# EAGLE schematic greenhousectrl-latest-monday-no-errors-fixed-cap (EAGLE 7.7.0)
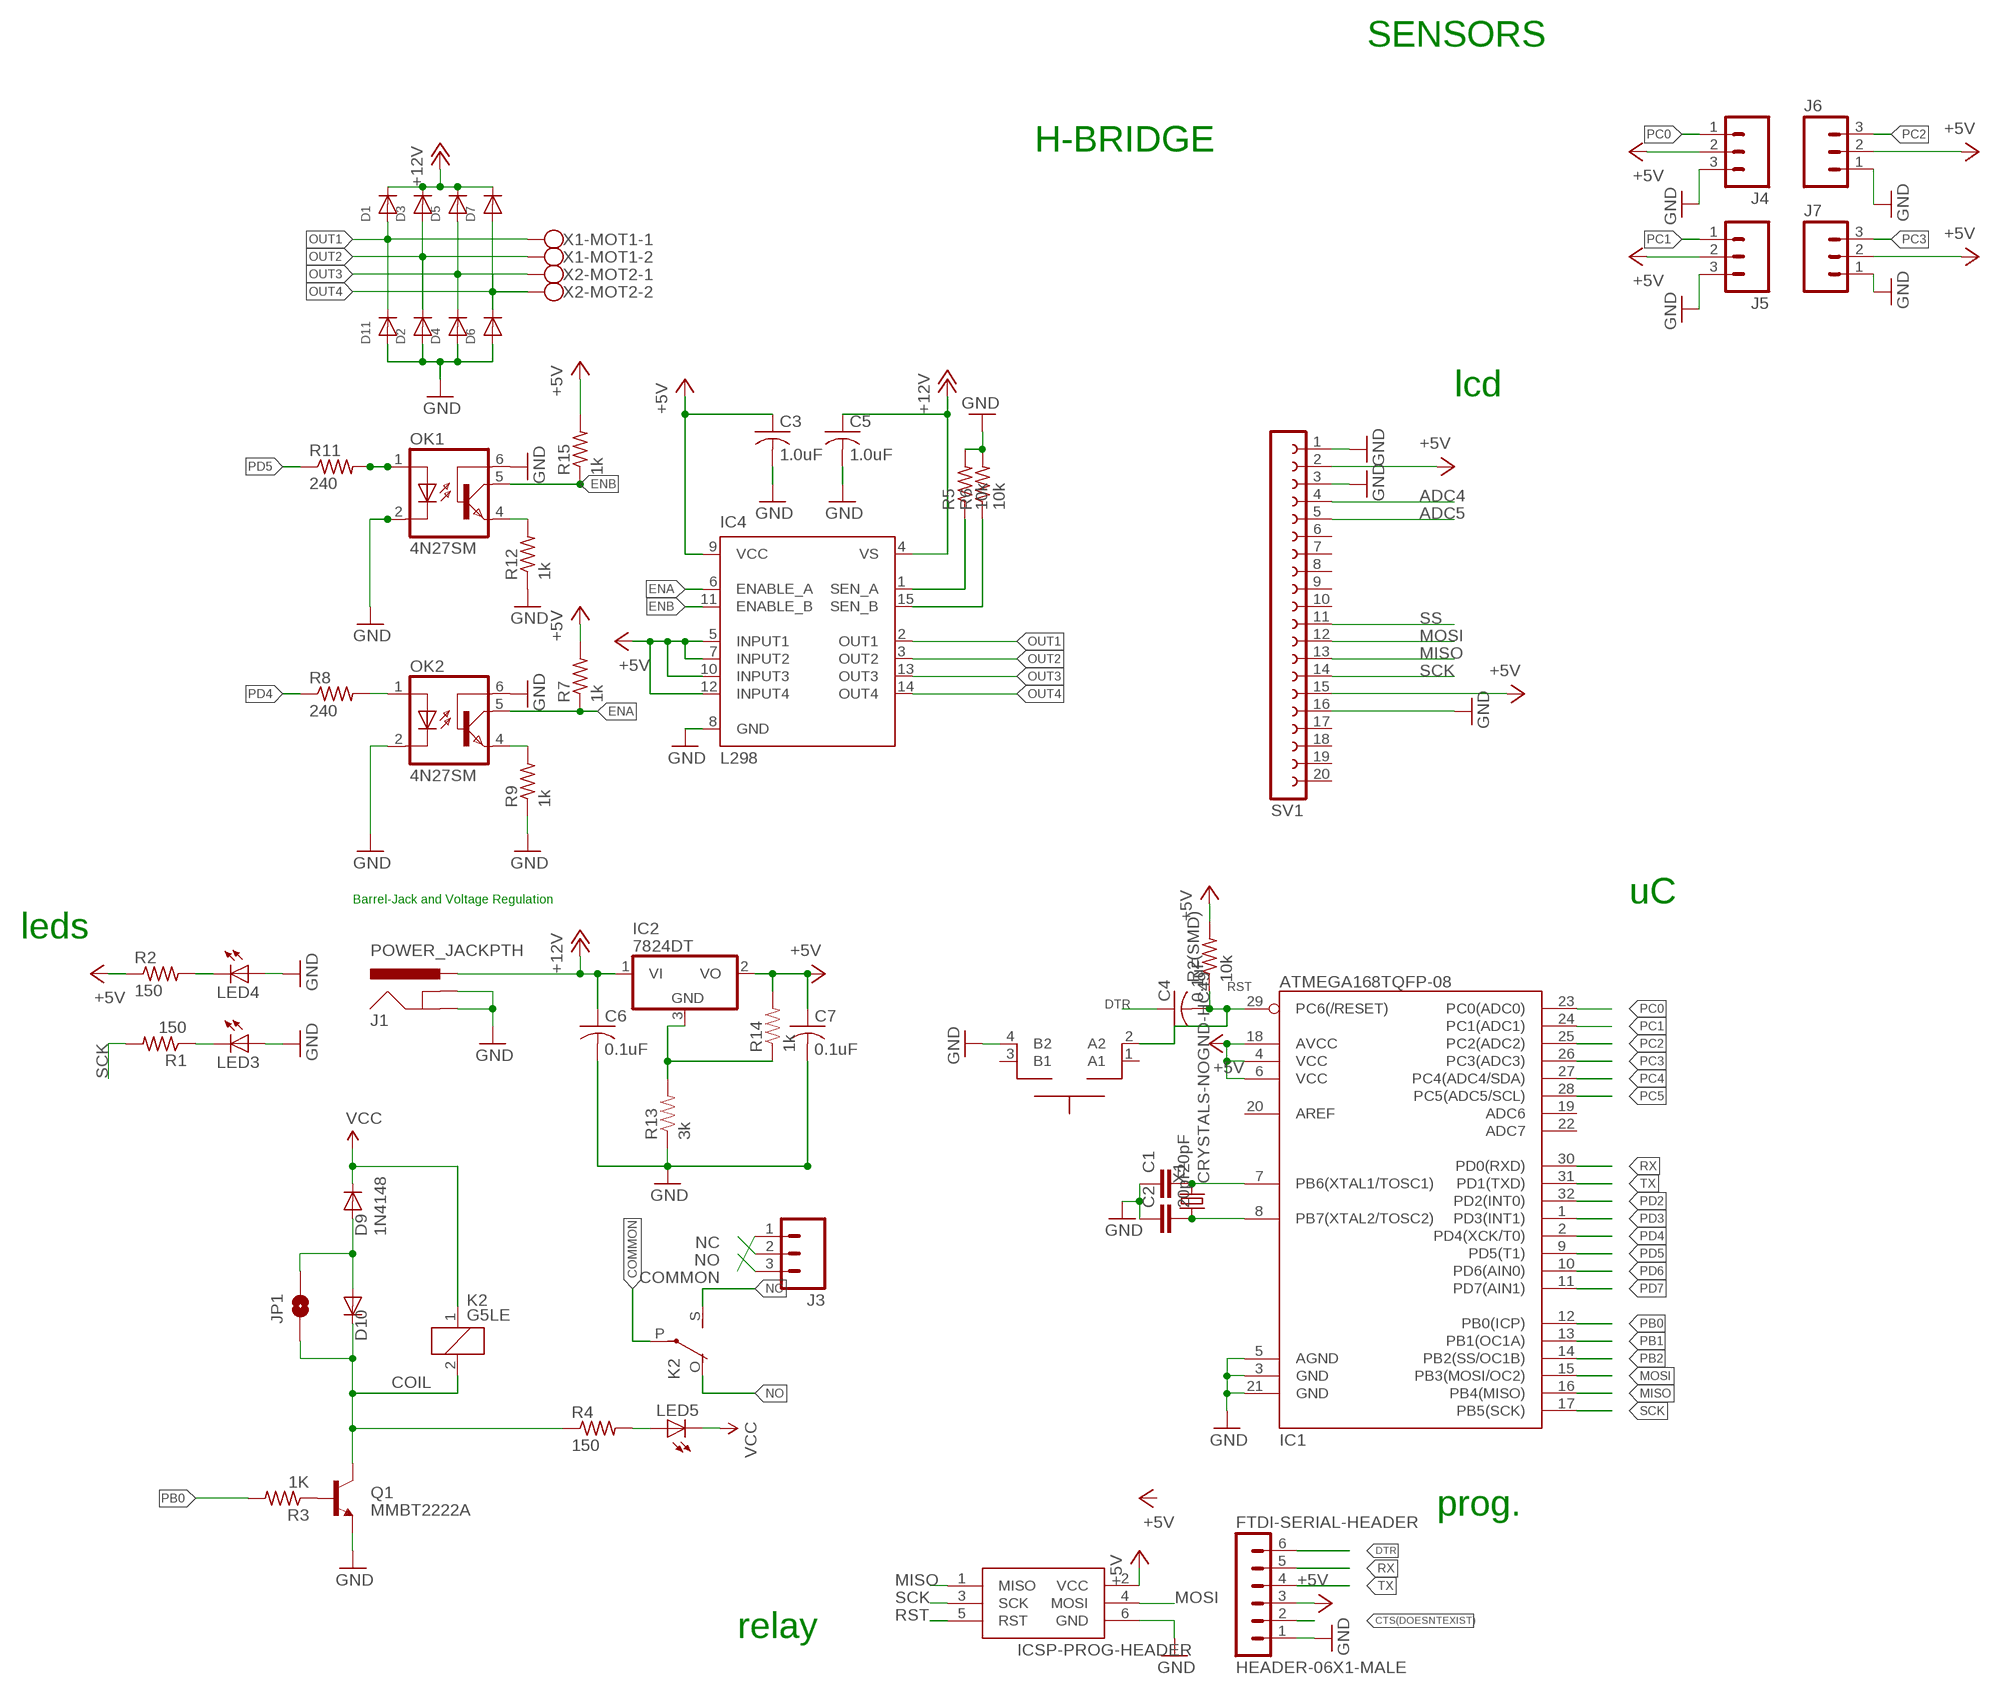
[diagram p0: schematic, sheet 1]

## Parts
C1  20pF  C-EUC0805  [C0805]
C2  20pF  C-EUC0805  [C0805]
C3  1.0uF  C-USC0805  [C0805]
C4  0.1uF  C-USC0805  [C0805]
C5  1.0uF  C-USC0805  [C0805]
C6  0.1uF  C-USC0805  [C0805]
C7  0.1uF  C-USC0805  [C0805]
D1  DIODESOD-523  [SOD-523]
D2  DIODESOD-523  [SOD-523]
D3  DIODESOD-523  [SOD-523]
D4  DIODESOD-523  [SOD-523]
D5  DIODESOD-523  [SOD-523]
D6  DIODESOD-523  [SOD-523]
D7  DIODESOD-523  [SOD-523]
D9  1N4148  DIODESOD-323F  [SOD-323F]
D10  Zener  DIODESOD-323F  [SOD-323F]
D11  DIODESOD-523  [SOD-523]
FTDI-SERIAL-HEADER  HEADER-06X1-MALE  [06X1-PTH]
IC1  ATMEGA168TQFP-08  [TQFP32-08]
IC2  7824DT  [TO252]
IC4  L298  [MULTIWATT-15]
ICSP-PROG-HEADER  AVRISP-6  [AVRISP]
J1  POWER_JACKPTH  [POWER_JACK_PTH]
J3  M03-SCREW-5MM  [SCREWTERMINAL-5MM-3]
J4  M03SCREW_LOCK  [SCREWTERMINAL-3.5MM-3_LOCK.007S]
J5  M03SCREW_LOCK  [SCREWTERMINAL-3.5MM-3_LOCK.007S]
J6  M03SCREW_LOCK  [SCREWTERMINAL-3.5MM-3_LOCK.007S]
J7  M03SCREW_LOCK  [SCREWTERMINAL-3.5MM-3_LOCK.007S]
JP1  JUMPER-PAD-2-NOYES_SILK  [PAD-JUMPER-2-NO_YES_SILK]
K2  G5LE  [G5LE]
LED3  LEDCHIP-LED0805  [CHIP-LED0805]
LED4  LEDCHIP-LED0805  [CHIP-LED0805]
LED5  LEDCHIP-LED0805  [CHIP-LED0805]
OK1  4N27SM  [DIL6-SMD]
OK2  4N27SM  [DIL6-SMD]
Q1  MMBT2222A  TRANSISTOR_NPNMMBT2222A  [SOT23-3]
R1  150  R-US_M0805  [M0805]
R2  150  R-US_M0805  [M0805]
R2(SMD)  10k  R-US_M0805  [M0805]
R3  1K  R-US_M0805  [M0805]
R4  150  R-US_M0805  [M0805]
R5  10k  R-US_M0805  [M0805]
R6  10k  R-US_M0805  [M0805]
R7  1k  R-US_M0805  [M0805]
R8  240  R-US_M0805  [M0805]
R9  1k  R-US_M0805  [M0805]
R11  240  R-US_M0805  [M0805]
R12  1k  R-US_M0805  [M0805]
R13  3k  RESISTOR0402  [0402-RES]
R14  1k  RESISTOR0402  [0402-RES]
R15  1k  R-US_M0805  [M0805]
SV1  FE20-1  [FE20]
SW2  MOMENTARYBUTTON  [SPST_NO_SMD]
X1  CRYSTALS-NOGND-HC49  [HC49]
X1-MOT1  W237-102  [W237-102]
X2-MOT2  W237-102  [W237-102]

## Nets
+5V: C3.1 C7.1 FTDI-SERIAL-HEADER.3 IC1.4(VCC) IC1.6(VCC) IC1.18(AVCC) IC2.2(VO) IC4.5(INPUT1) IC4.7(INPUT2) IC4.9(VCC) IC4.10(INPUT3) IC4.12(INPUT4) ICSP-PROG-HEADER.2(VCC) J4.2 J5.2 J6.2 J7.2 R2(SMD).2 R2.1 R7.2 R14.2 R15.2 SV1.2 SV1.15
+12V: C5.1 C6.1 D1.K(C) D3.K(C) D5.K(C) D7.K(C) IC2.1(VI) IC4.4(VS) J1.PWR
ADC4: SV1.4
ADC5: SV1.5
COIL: D10.C JP1.1 K2.2 Q1.3(C) R4.1
COMMON: J3.1 K2.P(2:P)
CTS(DOESNTEXIST): FTDI-SERIAL-HEADER.2
DIODENODE: D9.A D10.A JP1.2
DTR: C4.1 FTDI-SERIAL-HEADER.6
ENA: IC4.6(ENABLE_A) OK2.5(COL) R7.1
ENB: IC4.11(ENABLE_B) OK1.5(COL) R15.1
GND: C1.1 C2.1 C3.2 C5.2 C6.2 C7.2 D2.A D4.A D6.A D11.A FTDI-SERIAL-HEADER.1 IC1.3(GND) IC1.5(AGND) IC1.21(GND) IC4.8(GND) ICSP-PROG-HEADER.6(GND) J1.GND J1.GNDBREAK J4.3 J5.3 J6.1 J7.1 LED3.A LED4.A OK1.2(C) OK1.6(BAS) OK2.2(C) OK2.6(BAS) Q1.2(E) R5.2 R6.2 R9.1 R12.1 R13.1 SV1.1 SV1.3 SV1.16 SW2.4(B2)
MISO: IC1.16(PB4(MISO)) ICSP-PROG-HEADER.1(MISO) SV1.13
MOSI: IC1.15(PB3(MOSI/OC2)) ICSP-PROG-HEADER.4(MOSI) SV1.12
N$1: OK2.1(A) R8.2
N$2: LED4.C R2.2
N$3: LED5.A R4.2
N$5: OK2.4(EMI) R9.2
N$6: Q1.1(B) R3.1
N$7: IC2.3(GND) R13.2 R14.1
N$8: OK1.1(A) R11.2
N$10: LED3.C R1.1
N$11: C1.2 IC1.7(PB6(XTAL1/TOSC1)) X1.2
N$13: C2.2 IC1.8(PB7(XTAL2/TOSC2)) X1.1
N$15: OK1.4(EMI) R12.2
NC: J3.2 K2.S(2:S)
NO: J3.3 K2.O(2:O)
OUT1: D1.A D11.K(C) IC4.2(OUT1) X1-MOT1.1
OUT2: D2.K(C) D3.A IC4.3(OUT2) X1-MOT1.2
OUT3: D4.K(C) D5.A IC4.13(OUT3) X2-MOT2.1
OUT4: D6.K(C) D7.A IC4.14(OUT4) X2-MOT2.2
PB0: IC1.12(PB0(ICP)) R3.2
PB1: IC1.13(PB1(OC1A))
PB2: IC1.14(PB2(SS/OC1B))
PC0: IC1.23(PC0(ADC0)) J4.1
PC1: IC1.24(PC1(ADC1)) J5.1
PC2: IC1.25(PC2(ADC2)) J6.3
PC3: IC1.26(PC3(ADC3)) J7.3
PC4: IC1.27(PC4(ADC4/SDA))
PC5: IC1.28(PC5(ADC5/SCL))
PD2: IC1.32(PD2(INT0))
PD3: IC1.1(PD3(INT1))
PD4: IC1.2(PD4(XCK/T0)) R8.1
PD5: IC1.9(PD5(T1)) R11.1
PD6: IC1.10(PD6(AIN0))
PD7: IC1.11(PD7(AIN1))
RST: C4.2 IC1.29(PC6(/RESET)) ICSP-PROG-HEADER.5(RST) R2(SMD).1 SW2.2(A2)
RX: FTDI-SERIAL-HEADER.5 IC1.30(PD0(RXD))
SCK: IC1.17(PB5(SCK)) ICSP-PROG-HEADER.3(SCK) R1.2 SV1.14
SEN_A: IC4.1(SEN_A) R5.1
SEN_B: IC4.15(SEN_B) R6.1
SS: SV1.11
TX: FTDI-SERIAL-HEADER.4 IC1.31(PD1(TXD))
VCC: D9.C K2.1 LED5.C
Unconnected: IC1.19(ADC6) IC1.20(AREF) IC1.22(ADC7) SV1.6 SV1.7 SV1.8 SV1.9 SV1.10 SV1.17 SV1.18 SV1.19 SV1.20 SW2.1(A1) SW2.3(B1)

## Notes on the sheet
- SENSORS
- H-BRIDGE
- lcd
- Barrel-Jack and Voltage Regulation | uC
- leds
- prog.
- relay

## Library data of the parts
C1 C2 = resistor:C-EU: CAPACITOR, European symbol
C3-C7 = adafruit:C-US: CAPACITOR, American symbol
D1-D7 D10 D11 = adafruit:DIODE: Diode SMADIODE - SMA Surface Mount Package 20V 1A Schottky Diode Digikey: 641-1014-6-ND DO-1N4148 - Through Hole Small Current Diode SOD-123 20V 1 A (.5mV Vf) Schottky Diode - Digikey: MBRX120TPMSCT-ND SOD-323 10V 570mA (.38mV Vf, 3ns) Schottky Diode - Digikey: ZLLS410CT-ND SOD-523 30V 30mA Schottky Diode (RB751S-40TE61) - Digikey: RB751S-40TE61CT-ND SOT23-R/W - SOT23 Package (R = Solder Paste/Reflow Ovens, W = Hand-Soldering) BAT54Film 40V 300mA - Digikey: 497-7162-1-ND
D9 = adafruit:DIODE: Diode SMADIODE - SMA Surface Mount Package 20V 1A Schottky Diode Digikey: 641-1014-6-ND DO-1N4148 - Through Hole Small Current Diode SOD-123 20V 1 A (.5mV Vf) Schottky Diode - Digikey: MBRX120TPMSCT-ND SOD-323 10V 570mA (.38mV Vf, 3ns) Schottky Diode - Digikey: ZLLS410CT-ND SOD-523 30V 30mA Schottky Diode (RB751S-40TE61) - Digikey: RB751S-40TE61CT-ND SOT23-R/W - SOT23 Package (R = Solder Paste/Reflow Ovens, W = Hand-Soldering) BAT54Film 40V 300mA - Digikey: 497-7162-1-ND; PROD_ID: DIO-08378
FTDI-SERIAL-HEADER = GeekAmmo:HEADER-06X1?: 6 x 0.1 inch Header 40x1 0.1inch Male Breakaway header can be used. - 4UCON 00834 <http://www.4uconnector.com/online/SearchPro.asp?FormName=ProSearch&FormAction=search&s_GroupNo=&s_keyword=00834> For female part, if possible use 6 x 1 without breaking.; OTHER: 4UCON 00834; URL: http://www.4uconnector.com/online/SearchPro.asp?FormName=ProSearch&FormAction=search&s_GroupNo=&s_keyword=00834
IC1 = atmega328p:ATMEGA168
IC2 = linear:78*: Positive VOLTAGE REGULATOR Source: http://cache.national.com/ds/LM/LM78L05.pdf http://www.fairchildsemi.com/ds/LM/LM7805.pdf
IC4 = st-microelectronics:L298: DUAL FULL-BRIDGE DRIVER; MPN: L298N; OC_FARNELL: 1589425; OC_NEWARK: 32M1527
ICSP-PROG-HEADER = adafruit:AVRISP: AVR ISP HEADER Standard 6 pin header for AVR programming
J1 = SparkFun-Connectors:POWER_JACK: Power Jack This is the standard 5.5mm barrel jack for power. The PTH is the most common, proven, reliable, footprint. The Slot footprint only works if the mill layer is transmitted to the PCB fab house so be warned. Mating wall wart : TOL-00298 (and others); PROD_ID: CONN-08197
J3 = SparkFun-Connectors:M03: Header 3 Standard 3-pin 0.1" header. Use with straight break away headers (SKU : PRT-00116), right angle break away headers (PRT-00553), swiss pins (PRT-00743), machine pins (PRT-00117), and female headers (PRT-00115). Molex polarized connector foot print use with SKU : PRT-08232 with associated crimp pins and housings.; PROD_ID: CONN-10134; STOREFRONT_ID: PRT-08433
J4-J7 = SparkFun-Connectors:M03: Header 3 Standard 3-pin 0.1" header. Use with straight break away headers (SKU : PRT-00116), right angle break away headers (PRT-00553), swiss pins (PRT-00743), machine pins (PRT-00117), and female headers (PRT-00115). Molex polarized connector foot print use with SKU : PRT-08232 with associated crimp pins and housings.; PROD_ID: CONN-08288
JP1 = SparkFun-Passives:JUMPER-PAD-2-NO
K2 = relay:G5LE: RELAY 1 x switch, 10 A/120 V AC, 8 A/30 V DC, Omron; OC_FARNELL: unknown; OC_NEWARK: unknown
LED3-LED5 = adafruit:LED: LED OSRAM: - CHIPLED LG R971, LG N971, LY N971, LG Q971, LY Q971, LO R971, LY R971 LH N974, LH R974 LS Q976, LO Q976, LY Q976 LO Q996 - Hyper CHIPLED LW Q18S LB Q993, LB Q99A, LB R99A - SideLED LS A670, LO A670, LY A670, LG A670, LP A670 LB A673, LV A673, LT A673, LW A673 LH A674 LY A675 LS A676, LA A676, LO A676, LY A676, LW A676 LS A679, LY A679, LG A679 - Hyper Micro SIDELED® LS Y876, LA Y876, LO Y876, LY Y876 LT Y87S - SmartLED LW L88C, LW L88S LB L89C, LB L89S, LG L890 LS L89K, LO L89K, LY L89K LS L896, LA L896, LO L896, LY L896 - TOPLED LS T670, LO T670, LY T670, LG T670, LP T670 LSG T670, LSP T670, LSY T670, LOP T670, LYG T670 LG T671, LOG T671, LSG T671 LB T673, LV T673, LT T673, LW T673 LH T674 LS T676, LA T676, LO T676, LY T676, LB T676, LH T676, LSB T676, LW T676 LB T67C, LV T67C, LT T67C, LS T67K, LO T67K, LY T67K, LW E67C LS E67B, LA E67B, LO E67B, LY E67B, LB E67C, LV E67C, LT E67C LW T67C LS T679, LY T679, LG T679 LS T770, LO T770, LY T770, LG T770, LP T770 LB T773, LV T773, LT T773, LW T773 LH T774 LS E675, LA E675, LY E675, LS T675 LS T776, LA T776, LO T776, LY T776, LB T776 LHGB T686 LT T68C, LB T68C - Hyper Mini TOPLED® LB M676 - Mini TOPLED Santana® LG M470 LS M47K, LO M47K, LY M47K Source: http://www.osram.convergy.de/
OK1 OK2 = optocoupler:4N*?M: General Purpose 6-Pin Phototransistor Optocouplers Source: http://www.fairchildsemi.com/ds/4N/4N35-M.pdf; MF: FAIRCHILD SEMICONDUCTOR; MPN: 4N27S-M; OC_FARNELL: unknown; OC_NEWARK: 05C3300
Q1 = SparkFun-DiscreteSemi:TRANSISTOR_NPN: Generic NPN BJT MMBT2222A - TRANS-08049 (SOT-23, 1A 40V) MPSA42 - TRANS-09116 (SOT-23, 500mA 300V) MMBT5088LT1G - TRANS-11160 (SOT-23, 50 mA 30V) BC547 - COM-08928 <http://www.sparkfun.com/products/8928> (TO-92 45V 100mA) (1.Collector 2.Base 3.Emitter) 2N3904 - COM-00521 <http://www.sparkfun.com/products/521> (TO-92 40V 200mA) (1.Emitter 2.Base 3.Collector) P2N2222A - COM-12852 <http://www.sparkfun.com/products/12852> (TO-92 40V 600mA) (1.Collector 2.Base 3.Emitter); PROD_ID: TRANS-08049
R1 R2 R2(SMD) R3-R9 R11 R12 R15 = adafruit:R-US_: RESISTOR, American symbol
R13 R14 = SparkFun-Resistors:RESISTOR: Resistor Basic schematic elements and footprints for 0603, 1206, and PTH resistors.
SV1 = con-lsta:FE20-1: FEMALE HEADER; OC_FARNELL: unknown; OC_NEWARK: unknown
SW2 = ece388:MOMENTARYBUTTON
X1 = IQD-Frequency-Products:CRYSTALS-NOGND: CRYSTALS CAN NOT GROUNDED
X1-MOT1 X2-MOT2 = con-wago-500:W237-102: WAGO SCREW CLAMP; MPN: 237-102; OC_FARNELL: unknown; OC_NEWARK: 70K9898